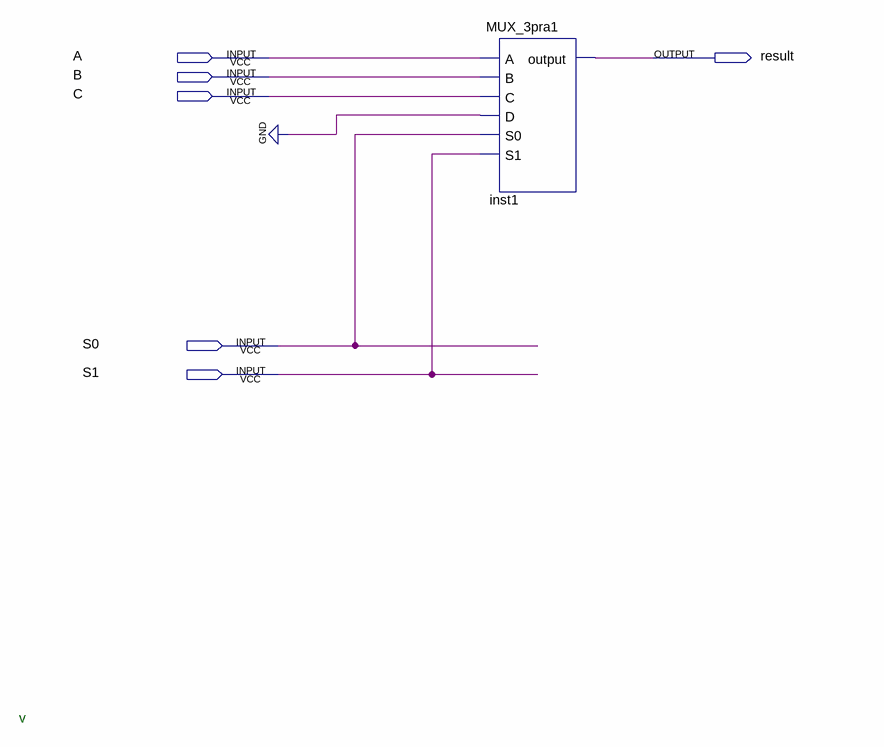
[diagram p0: schematic sheet]
// Quartus schematic Binary_MUX.bdf as structural Verilog: 1 symbols, 6 pins
module Binary_MUX (
  input  A,
  input  B,
  input  C,
  input  S0,
  input  S1,
  output result
);

  MUX_3pra1 inst1 (.A(A), .B(B), .C(C), .D(1'b0), .S0(S0), .S1(S1), .\output (result));

  // Notes on the sheet:
  //   v
endmodule
